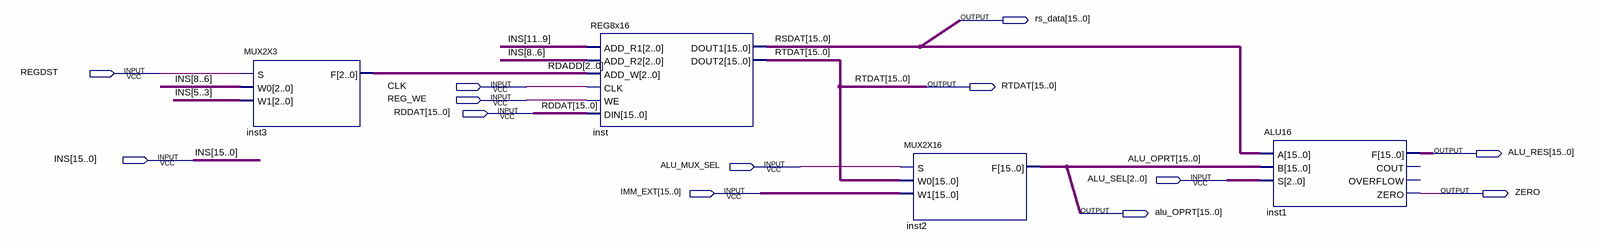
[diagram p0: schematic sheet]
// Quartus schematic M16DP2.bdf as structural Verilog: 4 symbols, 13 pins
module M16DP2 (
  input  REGDST,
  input  CLK,
  input  REG_WE,
  input  [15:0] RDDAT,
  input  [15:0] INS,
  input  ALU_MUX_SEL,
  input  [2:0] ALU_SEL,
  input  [15:0] IMM_EXT,
  output [15:0] rs_data,
  output [15:0] RTDAT,
  output [15:0] ALU_RES,
  output ZERO,
  output [15:0] alu_OPRT
);

  wire [2:0] RDADD;

  MUX2X3 inst3 (.S(REGDST), .W0(INS[8:6]), .W1(INS[5:3]), .F(RDADD));
  REG8x16 inst (
    .ADD_R1(INS[11:9]), .ADD_R2(INS[8:6]), .ADD_W(RDADD), .CLK(CLK), .WE(REG_WE), .DIN(RDDAT),
    .DOUT1(rs_data), .DOUT2(RTDAT));
  MUX2X16 inst2 (.S(ALU_MUX_SEL), .W0(RTDAT), .W1(IMM_EXT), .F(alu_OPRT));
  ALU16 inst1 (.A(rs_data), .B(alu_OPRT), .S(ALU_SEL), .F(ALU_RES), .ZERO(ZERO));  // open: COUT, OVERFLOW

  // Other names for the same wires on the sheet: RSDAT[15:0] = rs_data
endmodule
